# Altium schematic sheet [13]-LED_INDICATION.SchDoc
size A4
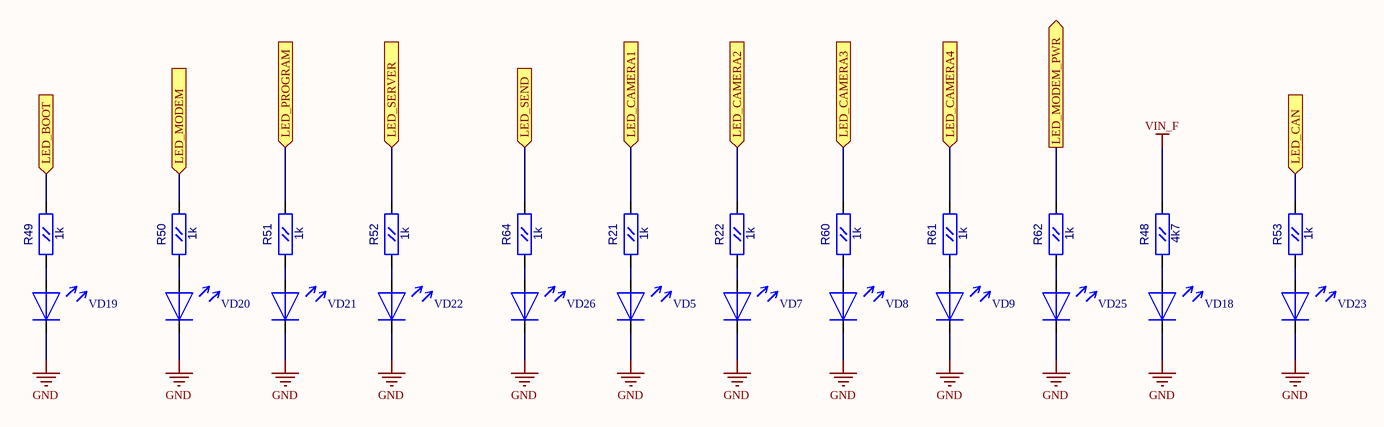
[diagram p0: [13]-LED_INDICATION.SchDoc]

## Parts
R21  1k  [RC0603]
R22  1k  [RC0603]
R48  4k7  [RC0603]
R49  1k  [RC0603]
R50  1k  [RC0603]
R51  1k  [RC0603]
R52  1k  [RC0603]
R53  1k  [RC0603]
R60  1k  [RC0603]
R61  1k  [RC0603]
R62  1k  [RC0603]
R64  1k  [RC0603]
VD5  LED_0805  [LED0805]  (value not drawn)
VD7  LED_0805  [LED0805]  (value not drawn)
VD8  LED_0805  [LED0805]  (value not drawn)
VD9  LED_0805  [LED0805]  (value not drawn)
VD18  LED_0805  [LED0805]  (value not drawn)
VD19  LED_0805  [LED0805]  (value not drawn)
VD20  LED_0805  [LED0805]  (value not drawn)
VD21  LED_0805  [LED0805]  (value not drawn)
VD22  LED_0805  [LED0805]  (value not drawn)
VD23  LED_0805  [LED0805]  (value not drawn)
VD25  LED_0805  [LED0805]  (value not drawn)
VD26  LED_0805  [LED0805]  (value not drawn)

## Ports
LED_BOOT (in), LED_CAMERA1 (in), LED_CAMERA2 (in), LED_CAMERA3 (in), LED_CAMERA4 (in), LED_CAN (in), LED_MODEM (in), LED_MODEM_PWR (out), LED_PROGRAM (in), LED_SEND (in), LED_SERVER (in)

## Nets
GND: VD5.2 VD7.2 VD8.2 VD9.2 VD18.2 VD19.2 VD20.2 VD21.2 VD22.2 VD23.2 VD25.2 VD26.2
VIN_F: R48.2(B)
LED_BOOT: R49.2(B) ; port LED_BOOT
LED_CAMERA1: R21.2(B) ; port LED_CAMERA1
LED_CAMERA2: R22.2(B) ; port LED_CAMERA2
LED_CAMERA3: R60.2(B) ; port LED_CAMERA3
LED_CAMERA4: R61.2(B) ; port LED_CAMERA4
LED_CAN: R53.2(B) ; port LED_CAN
LED_MODEM: R50.2(B) ; port LED_MODEM
LED_MODEM_PWR: R62.2(B) ; port LED_MODEM_PWR
LED_PROGRAM: R51.2(B) ; port LED_PROGRAM
LED_SEND: R64.2(B) ; port LED_SEND
LED_SERVER: R52.2(B) ; port LED_SERVER
NetR21_1: R21.1(A) VD5.1
NetR22_1: R22.1(A) VD7.1
NetR48_1: R48.1(A) VD18.1
NetR49_1: R49.1(A) VD19.1
NetR50_1: R50.1(A) VD20.1
NetR51_1: R51.1(A) VD21.1
NetR52_1: R52.1(A) VD22.1
NetR53_1: R53.1(A) VD23.1
NetR60_1: R60.1(A) VD8.1
NetR61_1: R61.1(A) VD9.1
NetR62_1: R62.1(A) VD25.1
NetR64_1: R64.1(A) VD26.1

## Library data of the parts
R21 R22 R48-R53 R60-R62 R64 = RC0603
  R21 R22 R49-R53 R60-R62 R64: Value: 1k
  R48: Value: 4k7
VD5 VD7-VD9 VD18-VD23 VD25 VD26 = LED_0805: Value: LED_0805